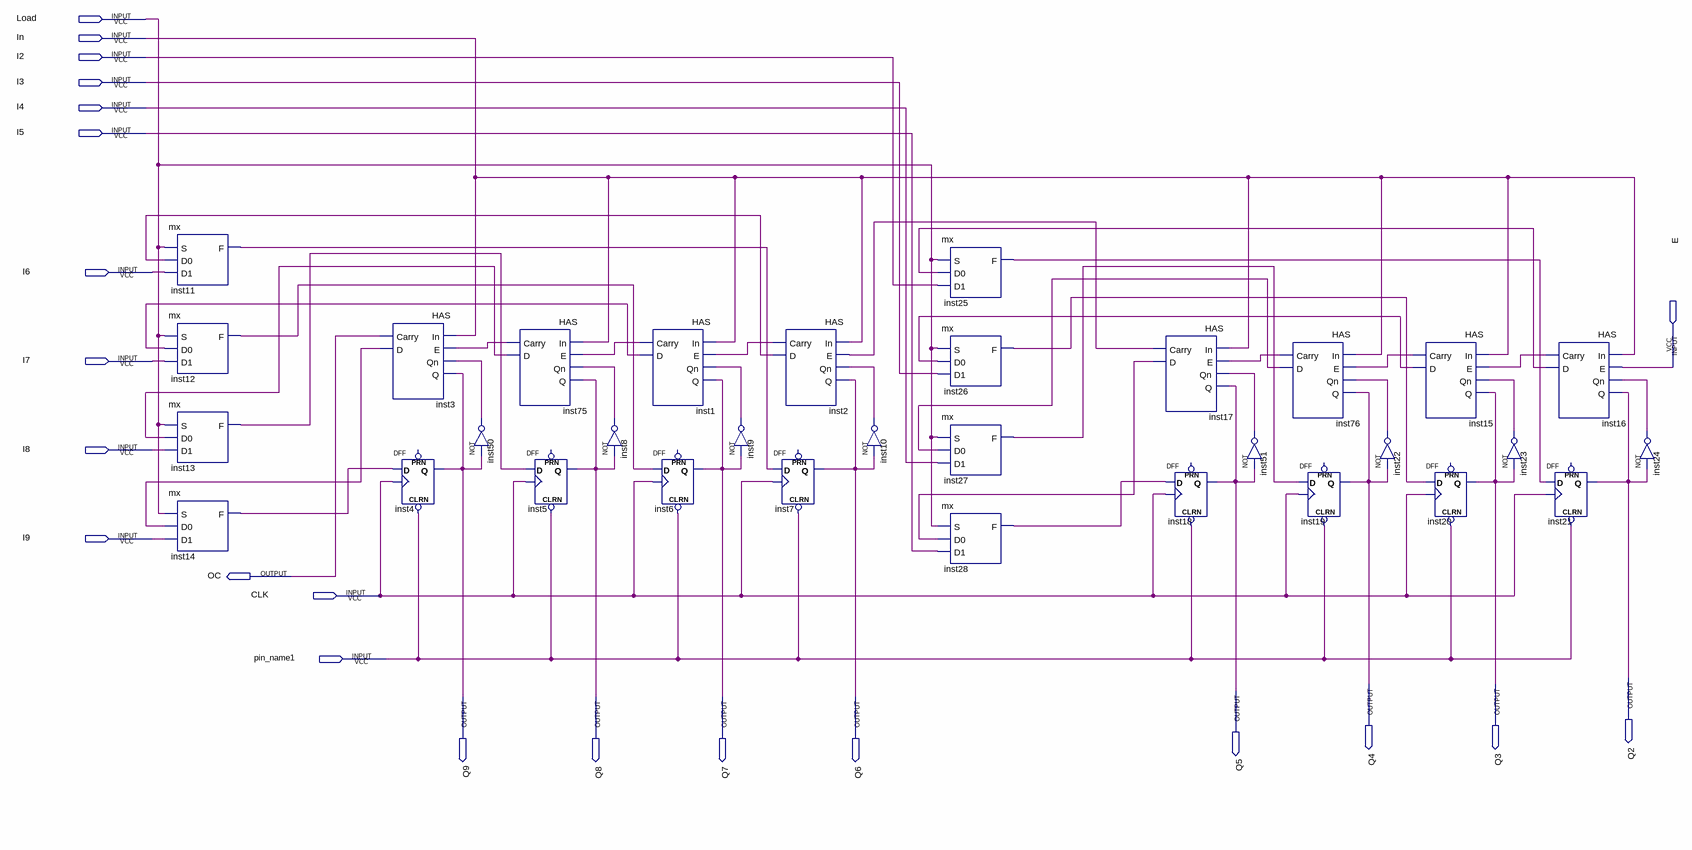
[diagram p0: schematic sheet]
// Quartus schematic Counter.bdf as structural Verilog: 32 symbols, 22 pins
module Counter (
  input  Load,
  input  In,
  input  I2,
  input  I3,
  input  I4,
  input  I5,
  input  I6,
  input  I7,
  input  E,
  input  I8,
  input  I9,
  input  CLK,
  input  pin_name1,
  output OC,
  output Q2,
  output Q4,
  output Q3,
  output Q5,
  output Q9,
  output Q8,
  output Q7,
  output Q6
);

  wire inst1_carry, inst1_d, inst2_carry, inst2_d, inst3_d, inst8_out, inst9_out, inst10_out, inst11_f,
       inst12_f, inst13_f, inst14_f, inst15_carry, inst15_d, inst16_carry, inst16_d, inst17_carry, inst17_d,
       inst22_out, inst23_out, inst24_out, inst25_f, inst26_f, inst27_f, inst28_f, inst50_out, inst51_out,
       inst75_carry, inst75_d, inst76_carry, inst76_d;

  mx inst11 (.S(Load), .D0(inst2_d), .D1(I6), .F(inst11_f));
  mx inst12 (.S(Load), .D0(inst1_d), .D1(I7), .F(inst12_f));
  mx inst13 (.S(Load), .D0(inst75_d), .D1(I8), .F(inst13_f));
  mx inst14 (.S(Load), .D0(inst3_d), .D1(I9), .F(inst14_f));
  HAS inst3 (.In(In), .E(inst75_carry), .Qn(inst50_out), .Q(Q9), .Carry(OC), .D(inst3_d));
  DFF inst4 (.CLRN(pin_name1), .CLK(CLK), .D(inst14_f), .Q(Q9));  // open: PRN
  not inst50 (inst50_out, Q9);
  HAS inst75 (.In(In), .E(inst1_carry), .Qn(inst8_out), .Q(Q8), .Carry(inst75_carry), .D(inst75_d));
  DFF inst5 (.CLRN(pin_name1), .CLK(CLK), .D(inst13_f), .Q(Q8));  // open: PRN
  not inst8 (inst8_out, Q8);
  HAS inst1 (.In(In), .E(inst2_carry), .Qn(inst9_out), .Q(Q7), .Carry(inst1_carry), .D(inst1_d));
  DFF inst6 (.CLRN(pin_name1), .CLK(CLK), .D(inst12_f), .Q(Q7));  // open: PRN
  not inst9 (inst9_out, Q7);
  HAS inst2 (.In(In), .E(inst17_carry), .Qn(inst10_out), .Q(Q6), .Carry(inst2_carry), .D(inst2_d));
  DFF inst7 (.CLRN(pin_name1), .CLK(CLK), .D(inst11_f), .Q(Q6));  // open: PRN
  not inst10 (inst10_out, Q6);
  mx inst25 (.S(Load), .D0(inst16_d), .D1(I2), .F(inst25_f));
  mx inst26 (.S(Load), .D0(inst15_d), .D1(I3), .F(inst26_f));
  mx inst27 (.S(Load), .D0(inst76_d), .D1(I4), .F(inst27_f));
  mx inst28 (.S(Load), .D0(inst17_d), .D1(I5), .F(inst28_f));
  HAS inst17 (.In(In), .E(inst76_carry), .Qn(inst51_out), .Q(Q5), .Carry(inst17_carry), .D(inst17_d));
  DFF inst18 (.CLRN(pin_name1), .CLK(CLK), .D(inst28_f), .Q(Q5));  // open: PRN
  not inst51 (inst51_out, Q5);
  HAS inst76 (.In(In), .E(inst15_carry), .Qn(inst22_out), .Q(Q4), .Carry(inst76_carry), .D(inst76_d));
  DFF inst19 (.CLRN(pin_name1), .CLK(CLK), .D(inst27_f), .Q(Q4));  // open: PRN
  HAS inst15 (.In(In), .E(inst16_carry), .Qn(inst23_out), .Q(Q3), .Carry(inst15_carry), .D(inst15_d));
  not inst22 (inst22_out, Q4);
  DFF inst20 (.CLRN(pin_name1), .CLK(CLK), .D(inst26_f), .Q(Q3));  // open: PRN
  not inst23 (inst23_out, Q3);
  HAS inst16 (.In(In), .E(E), .Qn(inst24_out), .Q(Q2), .Carry(inst16_carry), .D(inst16_d));
  DFF inst21 (.CLRN(pin_name1), .CLK(CLK), .D(inst25_f), .Q(Q2));  // open: PRN
  not inst24 (inst24_out, Q2);
endmodule
